# EAGLE schematic WeatherBoard (EAGLE 8.4.1)
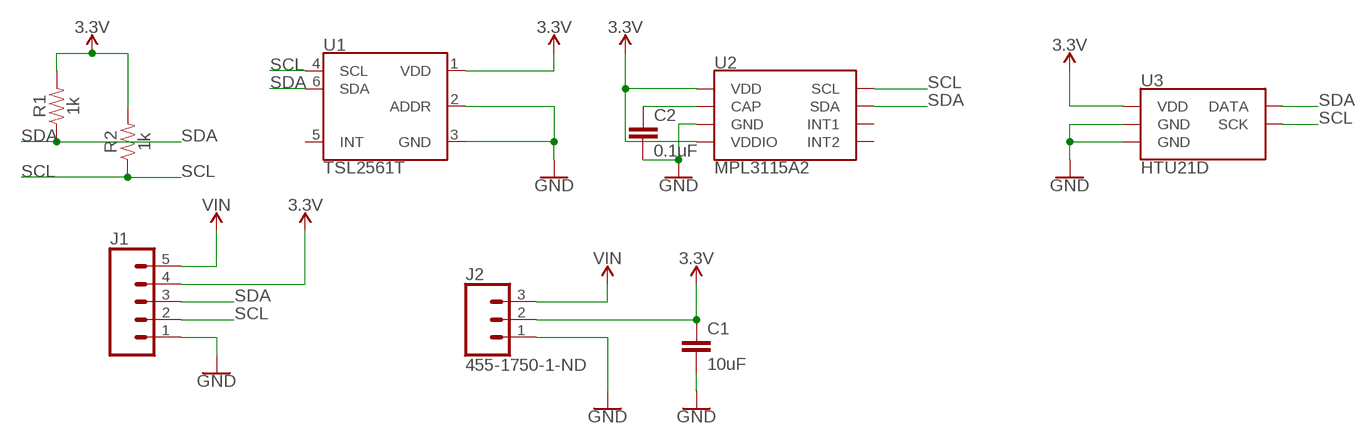
[diagram p0: schematic, sheet 1]

## Parts
C1  10uF  10UF-1206-6.3V-20%  [1206]
C2  0.1uF  0.1UF-0603-25V-5%  [0603]
J1  CONN_05  [1X05]
J2  455-1750-1-ND  CONN_03  [1X03]
R1  1k  1KOHM-0603-1/10W-1%  [0603]
R2  1k  1KOHM-0603-1/10W-1%  [0603]
U1  TSL2561T  [TMB-6]
U2  MPL3115A2  [LGA-8-5X3]
U3  HTU21D  [DFN-6-3X3-HTU21D]

## Nets
3.3V: C1.1 J1.4 J2.2 R1.2 R2.2 U1.1(VDD) U2.1(VDD) U2.4(VDDIO) U3.VDD
GND: C1.2 C2.2 J1.1 J2.1 U1.2(ADDR) U1.3(GND) U2.3(GND) U3.7(GND) U3.GND
N$6: C2.1 U2.2(CAP)
SCL: J1.2 R2.1 U1.4(SCL) U2.8(SCL) U3.SCK
SDA: J1.3 R1.1 U1.6(SDA) U2.7(SDA) U3.DATA
VIN: J1.5 J2.3
Unconnected: U1.5(INT) U2.5(INT2) U2.6(INT1)

## Library data of the parts
C1 = SparkFun-Capacitors:10UF: 10.0µF ceramic capacitors A capacitor is a passive two-terminal electrical component used to store electrical energy temporarily in an electric field.; PROD_ID: CAP-10057
C2 = SparkFun-Capacitors:0.1UF: 0.1µF ceramic capacitors A capacitor is a passive two-terminal electrical component used to store electrical energy temporarily in an electric field.; PROD_ID: CAP-08604
J1 = SparkFun-Connectors:CONN_05: Multi connection point. Often used as Generic Header-pin footprint for 0.1 inch spaced/style header connections On any of the 0.1 inch spaced packages, you can populate with these: Break Away Headers - Straight <https://www.sparkfun.com/products/116> (PRT-00116) Break Away Male Headers - Right Angle <https://www.sparkfun.com/products/553> (PRT-00553) Female Headers <https://www.sparkfun.com/products/115> (PRT-00115) Break Away Headers - Machine Pin <https://www.sparkfun.com/products/117> (PRT-00117) Break Away Female Headers - Swiss Machine Pin <https://www.sparkfun.com/products/743> (PRT-00743) For SCREWTERMINALS and SPRING TERMINALS visit here: Screw Terimnals on SparkFun.com <https://www.sparkfun.com/search/results?term=Screw+Terminals> (5mm/3.5mm/2.54mm spacing) This device is also useful as a general connection point to wire up your design to another part of your project. Our various solder wires solder well into these plated through hole pads. Hook-Up Wire - Assortment (Stranded, 22 AWG) <https://www.sparkfun.com/products/11375> (PRT-11375) Hook-Up Wire - Assortment (Solid Core, 22 AWG) <https://www.sparkfun.com/products/11367> (PRT-11367) View the entire wire category on our website here <https://www.sparkfun.com/categories/141> Special notes: Molex polarized connector foot print use with SKU : PRT-08231 with associated crimp pins and housings. 1MM SMD Version SKU: PRT-10208
J2 = SparkFun-Connectors:CONN_03: Multi connection point. Often used as Generic Header-pin footprint for 0.1 inch spaced/style header connections On any of the 0.1 inch spaced packages, you can populate with these: Break Away Headers - Straight <https://www.sparkfun.com/products/116> (PRT-00116) Break Away Male Headers - Right Angle <https://www.sparkfun.com/products/553> (PRT-00553) Female Headers <https://www.sparkfun.com/products/115> (PRT-00115) Break Away Headers - Machine Pin <https://www.sparkfun.com/products/117> (PRT-00117) Break Away Female Headers - Swiss Machine Pin <https://www.sparkfun.com/products/743> (PRT-00743) Stackable Header - 3 Pin (Female, 0.1") <https://www.sparkfun.com/products/13875> (PRT-13875) For SCREWTERMINALS and SPRING TERMINALS visit here: Screw Terimnals on SparkFun.com <https://www.sparkfun.com/search/results?term=Screw+Terminals> (5mm/3.5mm/2.54mm spacing) This device is also useful as a general connection point to wire up your design to another part of your project. Our various solder wires solder well into these plated through hole pads. Hook-Up Wire - Assortment (Stranded, 22 AWG) <https://www.sparkfun.com/products/11375> (PRT-11375) Hook-Up Wire - Assortment (Solid Core, 22 AWG) <https://www.sparkfun.com/products/11367> (PRT-11367) View the entire wire category on our website here <https://www.sparkfun.com/categories/141> Special notes: Molex polarized connector foot print use with SKU : PRT-08232 with associated crimp pins and housings.; PROD_ID: XXX-00000
R1 R2 = SparkFun-Resistors:1KOHM: 1kΩ resistor A resistor is a passive two-terminal electrical component that implements electrical resistance as a circuit element. Resistors act to reduce current flow, and, at the same time, act to lower voltage levels within circuits. - Wikipedia; PROD_ID: RES-07856
U1 = SparkFun-Sensors:TSL2561: TAOS TSL2561 Digital Luminosity (Light) Sensor The TSL2561 is a light-to-digital converter that transform light intensity to a digital signal output via I2C interface. The device combines one broadband photodiode (visible plus infrared) and one infrared-responding photodiode on a single CMOS integrated circuit capable of providing a near-photopic response over an effective 20-bit dynamic range (16-bit resolution). Two integrating ADCs convert the photodiode currents to a digital output that represents the irradiance measured on each channel. This digital output can be input to a microprocessor where illuminance (ambient light level) in lux is derived using an empirical formula to approximate the human eye response. The TSL2561 device supports a traditional level style interrupt that remains asserted until the firmware clears it. Datasheet <http://www.mouser.com/ds/2/588/ams_sl2560-e58-488842.pdf> SparkFun Products SparkFun Luminosity Sensor Breakout - TSL2561 <https://www.sparkfun.com/products/12055> (SEN-12055)
U2 = SparkFun-Sensors:MPL3115A2: NXP MPL3115A2 Digital Altimeter/Pressure Sensor The MPL3115A2 is a compact piezoresistive absolute pressure sensor with an I2C interface. MPL3115 has a wide operating range of 20kPa to 110 kPa, a range that covers all surface elevations on Earth. The fully internally compensated MEMS in conjunction with an embedded high resolution 24-bit equivalent ADC provide accurate pressure [Pascals] /altitude [meters] and temperature [degrees Celsius] data. Datasheet <http://cdn.sparkfun.com/datasheets/Sensors/Pressure/MPL3115A2.pdf> SparkFun Products SparkFun Altitude/Pressure Sensor Breakout - MPL3115A2 <https://www.sparkfun.com/products/11084> (SEN-11084) SparkFun Weather Shield <https://www.sparkfun.com/products/12081> (DEV-12081) SparkFun Photon Weather Shield <https://www.sparkfun.com/products/13630> (DEV-13630); PROD_ID: IC-10869
U3 = SparkFun-Sensors:HTU21D: Measurement Specialties HTU21D Relative Humidity Sensor w/ Temperature HTU21D(F) digital humidity sensors are dedicated humidity and temperature plug and play transducers for OEM applications where reliable and accurate measurements are needed. Direct interface with a micro-controller is made possible with the module for humidity and temperature digital outputs. These low power sensors are designed for high volume and cost sensitive applications with tight space constraints. Datasheet <http://cdn.sparkfun.com/datasheets/BreakoutBoards/HTU21D.pdf> SparkFun Products SparkFun Humidity and Temperature Sensor Breakout - HTU21D <https://www.sparkfun.com/products/12064> (SEN-12064) SparkFun Weather Shield <https://www.sparkfun.com/products/12081> (SEN-12081) SparkFun Photon Weather Shield <https://www.sparkfun.com/products/13630> (SEN-13630); PROD_ID: IC-11793